# Altium schematic sheet Sheet2.SchDoc
size A4; SheetNumber: 1; SheetTotal: 1
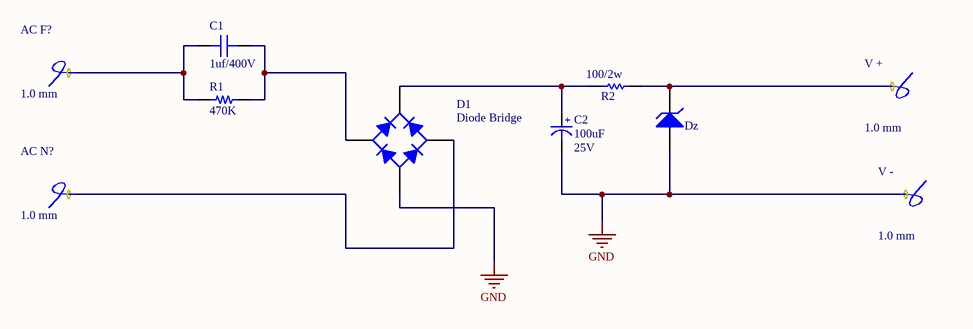
[diagram p0: Sheet2.SchDoc]

## Parts
AC_F?  Diameter: 1.0 mm  [wire 1.0 mm]  (hidden comment: *)
AC_N?  Diameter: 1.0 mm  [wire 1.0 mm]  (hidden comment: *)
C1  1uf/400V  [1uf 400v]
C2  value 100uF  Voltage: 25V  [cap 03]  (hidden comment: 100uf 25v)
D1  Diode Bridge  [Bridge KBJ PACKAGE]
Dz  1n5408  [Diode 1W]  (value not drawn)
R1  470K  [AXIAL-0.3]
R2  100/2w  [RES-(1/2)-Stand]
V_+  Diameter: 1.0 mm  [wire 1.0 mm]  (hidden comment: +)
V_-  Diameter: 1.0 mm  [wire 1.0 mm]  (hidden comment: -)

## Nets
GND: C2.2(-) D1.4(-) Dz.1(A) V_-.1(W)
NetAC_F?_1: AC_F?.1(W) C1.1 R1.1
NetAC_N?_1: AC_N?.1(W) D1.3(AC)
NetC1_2: C1.2 D1.2(AC) R1.2
NetC2_1: C2.1(+) D1.1(+) R2.1
NetDz_2: Dz.2(K) R2.2 V_+.1(W)

## Library data of the parts
AC_F? AC_N? V_+ V_- = Single Wire: A Customize Component For Single Wire Connection; Designer: Saeid Jorablo; Company: IPA Co; Adding Date: 1388/04/05; Color: Blue; Wire Name: *
C1 = Capacitor: SMT Capacitor
C2 = Cap-Polar: Polar Capacitor; Designer: Saeid Jorablo; Organazation: ControTec; Adding Date: 1387/12/20
D1 = Diode Bridge TOTAL SIZE: Full Wave Diode Bridge; Designer: Abbas Basereh; Design Date: 1395/11/09; ComponentLink1Description: Datasheet; ComponentLink2Description: Reference; Mounting Technology: Surface Mount\Through-Hole; Status: Unreleased
Dz = Diode Zener: Zener Diode; Designer: Saeid Jorablo; Company: E.P.I.L; Voltage: 3.3 V; Design Date: 2011/11/02
R1 = Resistor: SMT Resistor
R2 = Resistor vertical: Value: 330; Publisher: Seyed mohsen ghasemian; WEB: www.picpars.com